# Altium schematic sheet [14] - LTC3676.SchDoc
size A3
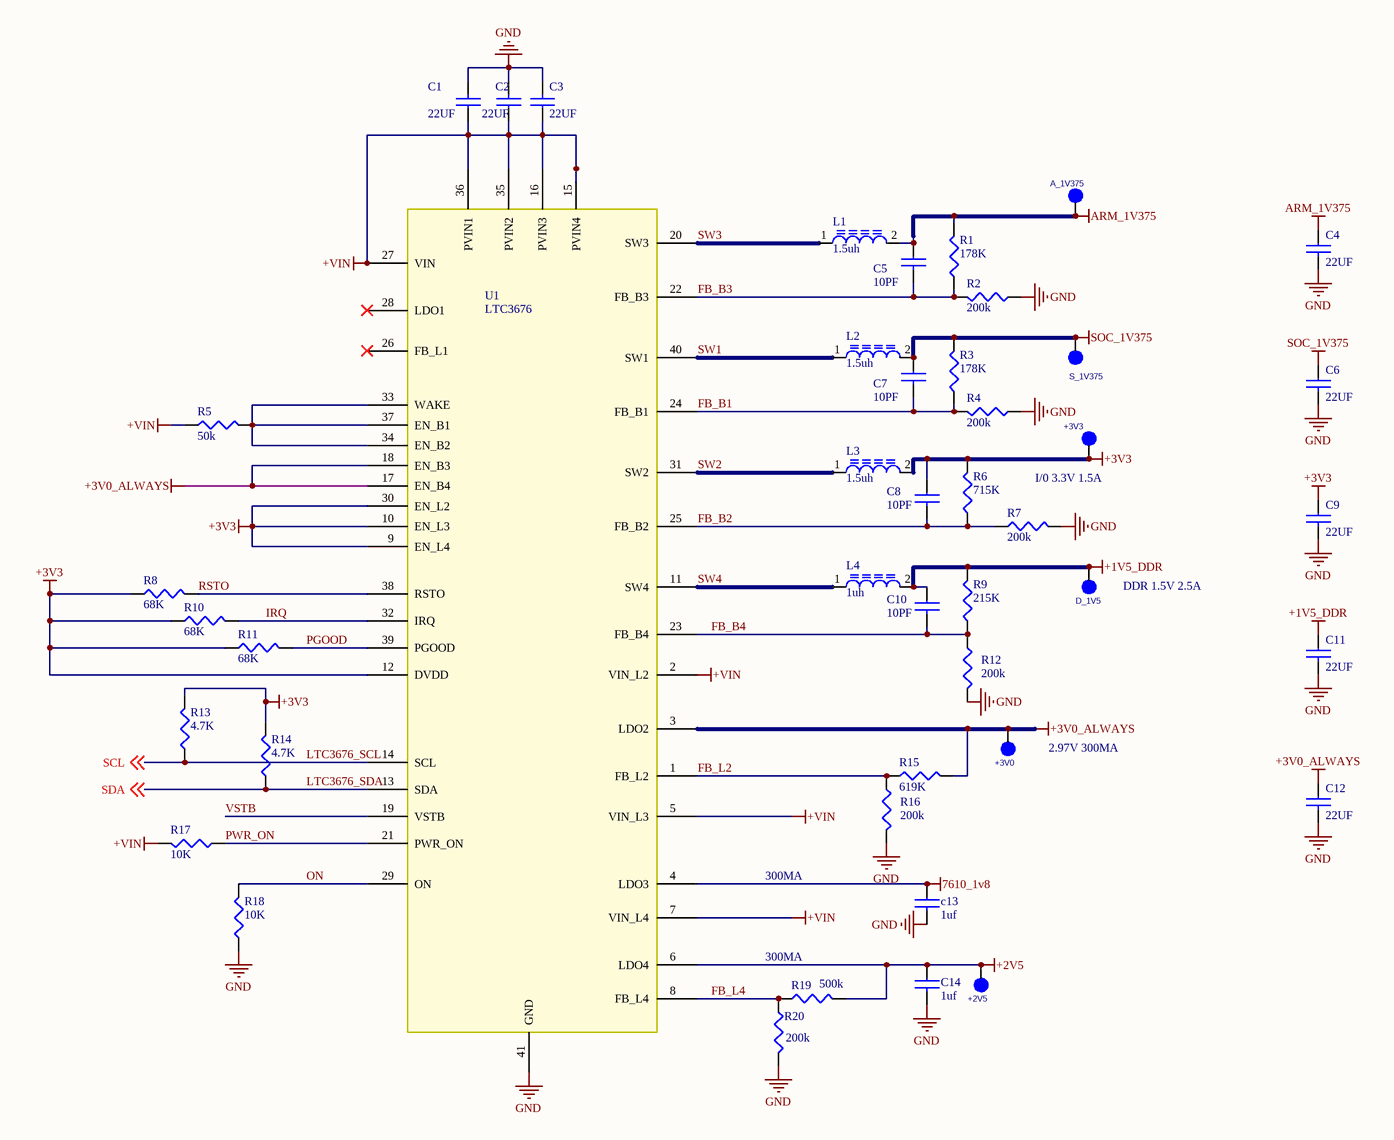
[diagram p0: [14] - LTC3676.SchDoc]

## Parts
+2V5  (no value)  [C035S]
+3V0  (no value)  [C035S]
+3V3  (no value)  [C035S]
A_1V375  (no value)  [C035S]
C1  22UF  [C1206A]
C2  22UF  [C1206A]
C3  22UF  [C1206A]
C4  22UF  [7343CAP]
C5  10PF  [C0402]
C6  22UF  [C1206A]
C7  10PF  [C0402]
C8  10PF  [C0402]
C9  22UF  [C1206A]
C10  10PF  [C0402]
C11  22UF  [C1206A]
C12  22UF  [C1206A]
c13  1uf  [C0402]
C14  1uf  [C0402]
D_1V5  (no value)  [C035S]
L1  1.5uh  [VLCF4020]
L2  1.5uh  [VLCF4020]
L3  1.5uh  [VLCF4020]
L4  1uh  [VLCF4020]
R1  178K  [R0402]
R2  200k  [R0402]
R3  178K  [R0402]
R4  200k  [R0402]
R5  50k  [R0402]
R6  715K  [R0402]
R7  200k  [R0402]
R8  68K  [R0402]
R9  215K  [R0402]
R10  68K  [R0402]
R11  68K  [R0402]
R12  200k  [R0402]
R13  4.7K  [R0402]
R14  4.7K  [R0402]
R15  619K  [R0402]
R16  200k  [R0402]
R17  10K  [R0402]
R18  10K  [R0402]
R19  500k  [R0402]
R20  200k  [R0402]
S_1V375  (no value)  [C035S]
U1  LTC3676  [qfn40]

## Nets
7610_1v8: c13.1 U1.4(LDO3)
+1V5_DDR: C10.1 C11.1 D_1V5.1(Pin1) L4.2 R9.2
+2V5: +2V5.1(Pin1) C14.1 R19.2 U1.6(LDO4)
+3V0_ALWAYS: +3V0.1(Pin1) C12.1 R15.2 U1.3(LDO2) U1.17(EN_B4) U1.18(EN_B3)
+3V3: +3V3.1(Pin1) C8.1 C9.1 L3.2 R6.2 R8.1 R10.1 R11.1 R13.2 R14.2 U1.9(EN_L4) U1.10(EN_L3) U1.12(DVDD) U1.30(EN_L2)
+VIN: C1.1 C2.1 C3.1 R5.1 R17.2 U1.2(VIN_L2) U1.5(VIN_L3) U1.7(VIN_L4) U1.15(PVIN4) U1.16(PVIN3) U1.27(VIN) U1.35(PVIN2) U1.36(PVIN1)
ARM_1V375: A_1V375.1(Pin1) C4.1 C5.1 L1.2 R1.2
GND: C1.2 C2.2 C3.2 C4.2 C6.2 C9.2 C11.2 C12.2 c13.2 C14.2 R2.1 R4.1 R7.2 R12.2 R16.2 R18.1 R20.2 U1.41(GND)
SOC_1V375: C6.1 C7.1 L2.2 R3.2 S_1V375.1(Pin1)
FB_B1: C7.2 R3.1 R4.2 U1.24(FB_B1)
FB_B2: C8.2 R6.1 R7.1 U1.25(FB_B2)
FB_B3: C5.2 R1.1 R2.2 U1.22(FB_B3)
FB_B4: C10.2 R9.1 R12.1 U1.23(FB_B4)
FB_L2: R15.1 R16.1 U1.1(FB_L2)
FB_L4: R19.1 R20.1 U1.8(FB_L4)
IRQ: R10.2 U1.32(IRQ)
LTC3676_SCL: R13.1 U1.14(SCL) ; off-sheet SCL  [also labelled SCL]
LTC3676_SDA: R14.1 U1.13(SDA) ; off-sheet SDA  [also labelled SDA]
ON: R18.2 U1.29(ON)
PGOOD: R11.2 U1.39(PGOOD)
PWR_ON: R17.1 U1.21(PWR_ON)
RSTO: R8.2 U1.38(RSTO)
SW1: L2.1 U1.40(SW1)
SW2: L3.1 U1.31(SW2)
SW3: L1.1 U1.20(SW3)
SW4: L4.1 U1.11(SW4)
VSTB: U1.19(VSTB)
NetR5_2: R5.2 U1.33(WAKE) U1.34(EN_B2) U1.37(EN_B1)

Not connected (* = marked no-connect by the designer): U1 26(FB_L1)* 28(LDO1)*

## Notes on the sheet
- I/0 3.3V 1.5A
- (near D_1V5) DDR 1.5V 2.5A
- (near +3V0) 2.97V 300MA
- 300MA

## Library data of the parts
+2V5 +3V0 +3V3 A_1V375 D_1V5 S_1V375 = TESTLOOP: TEST POINT PAD 0.5MM DIA SMT, NO PART TO ORDER; CLASS: IO; AGILE_PN: 211-77484; ASSY_OPT: DNP; CAD_APPROVED: Yes; ROHS: Yes; HEIGHT: 0.1MM
C1-C4 C6 C9 C11 C12 = C3216X5R1A107M: CAP CER 100UF 10V X5R 20% 1206; Manufacturer: TDK Corporation; Capacitance: 100礔; .Checked PCB: used; Tolerance: ?0%; Category: Capacitors; Manufacturer Part Number: C3216X5R1A107M; Operating Temperature: -55癈 ~ 85癈; Package / Case: 1206 (3216 Metric); Price 1k [$]: 0.85800; Value: 22UF; .Checked SCH: used; Voltage - Rated: 10V; Supplier Part Number: 445-6007-1-ND; Supplier: Digikey; Supplier 1: Digi-Key; Supplier Part Number 1: 445-6007-1-ND; RoHS: RoHS Compliant; Stock 1: 28026; Pricing 1: 1=1.65, 10=1.353, 100=1.089, 250=0.957, 500=0.891, 1000=0.693 (USD); Temperature Coefficient: X5R; Mounting Type: Surface Mount, MLCC; Applications: General Purpose; Ratings: -; Size / Dimension: 0.126" L x 0.063" W (3.20mm x 1.60mm); Height - Seated (Max): -; Thickness (Max): 0.071" (1.80mm); Lead Spacing: -; Features: -; Packaging: Cut Tape (CT); Lead Style: -; ComponentLink1URL: http://www.tdk.com/pdf/general_B11.pdf; ComponentLink1Description: http://www.tdk.com/pdf/general_B11.pdf
C5 C7 C8 C10 c13 C14 = C1005X5R1E224M: CAP CER .22UF 25V X5R 20% 0402; Manufacturer: TDK Corporation; Capacitance: 0.22礔; Value: 220nF; .Checked PCB: used; Tolerance: ?0%; Category: Capacitors; Supplier Part Number: 445-5945-1-ND; Manufacturer Part Number: C1005X5R1E224M; Operating Temperature: -55癈 ~ 85癈; Package / Case: 0402 (1005 Metric); Price 1k [$]: 0.02600; .Checked SCH: used; Voltage - Rated: 25V; Supplier: Digikey; Supplier 1: Digi-Key; Supplier Part Number 1: 445-5945-1-ND; RoHS: RoHS Compliant; Stock 1: 54593; Pricing 1: 1=0.3, 10=0.2, 100=0.08, 250=0.05752, 500=0.041, 1000=0.03 (USD); Temperature Coefficient: X5R; Mounting Type: Surface Mount, MLCC; Applications: General Purpose; Ratings: -; Size / Dimension: 0.039" L x 0.020" W (1.00mm x 0.50mm); Height - Seated (Max): -; Thickness (Max): 0.022" (0.55mm); Lead Spacing: -; Features: -; Packaging: Cut Tape (CT); Lead Style: -; ComponentLink1URL: http://www.tdk.co.jp/tefe02/e412_c.pdf; ComponentLink1Description: http://www.tdk.co.jp/tefe02/e412_c.pdf
L1-L4 = VLCF4020T-100MR85: INDUCTOR POWER 10UH .85A SMD; Manufacturer: TDK Corporation; Inductance: 10礖; Current Rating: 850mA; Tolerance: ?0%; Shielding: Shielded; DC Resistance (DCR): 185 mOhm Max; Frequency - Test: 100kHz; .Creator: MM; .Checked PCB: MM, checked by RF; Supplier 1: Digi-Key; Manufacturer Part Number: VLCF4020T-100MR85; RoHS: RoHS Compliant; Category: Inductors, Coils, Chokes; Stock 1: 53975; Pricing 1: 1=0.77, 10=0.68, 50=0.5526, 100=0.51, 500=0.442 (USD); Type: -; Current - Saturation: 850mA; Material - Core: -; Q @ Freq: -; Frequency - Self Resonant: -; Operating Temperature: -40癈 ~ 105癈; Package / Case: Non Standard; Size / Dimension: 0.157" L x 0.157" W x 0.079" H (4.00mm x 4.00mm x 2.00mm); Mounting Type: Surface Mount; Packaging: Cut Tape (CT); ComponentLink1URL: http://www.tdk.co.jp/tefe02/e531_vlcf.pdf; ComponentLink1Description: http://www.tdk.co.jp/tefe02/e531_vlcf.pdf; Supplier Part Number 1: 445-3186-1-ND; .Checked SCH: MM, checked by RF
R1-R20 = RC0402FR-0739KL: RES 39.0K OHM 1/16W 1% 0402 SMD; Manufacturer: Yageo; Resistance (Ohms): 39K; Power (Watts): 0.063W, 1/16W; Tolerance: ?%; Value: 39k; .Checked PCB: used; Temperature Coefficient: ?00ppm/癈; Category: Resistors; Manufacturer Part Number: RC0402FR-0739KL; Package / Case: 0402 (1005 Metric); Price 1k [$]: 0.01421; .Checked SCH: used; Supplier Part Number: 311-39.0KLRCT-ND; Supplier: Digikey; Supplier 1: Digi-Key; Supplier Part Number 1: 311-39.0KLRCT-ND; RoHS: RoHS Compliant; Stock 1: 36775; Pricing 1: 10=0.014, 50=0.0104, 100=0.0079, 250=0.00584, 500=0.00432, 1000=0.00288 (USD); Composition: Thick Film; Features: -; Size / Dimension: 0.039" L x 0.020" W (1.00mm x 0.50mm); Height: 0.016" (0.40mm); Number of Terminations: 2; Packaging: Cut Tape (CT); ComponentLink1URL: http://www.yageo.com/documents/recent/PYu-RC0402_51_RoHS_L_6.pdf; ComponentLink1Description: http://www.yageo.com/documents/recent/PYu-RC0402_51_RoHS_L_6.pdf